# Altium schematic sheet Reference_voltage.SchDoc: Reference voltage
size A4; Date: 6.4.2015; Engineer: Matjaž Tome; Revision: B; SheetNumber: 9; SheetTotal: 10; Project: USB DAQ
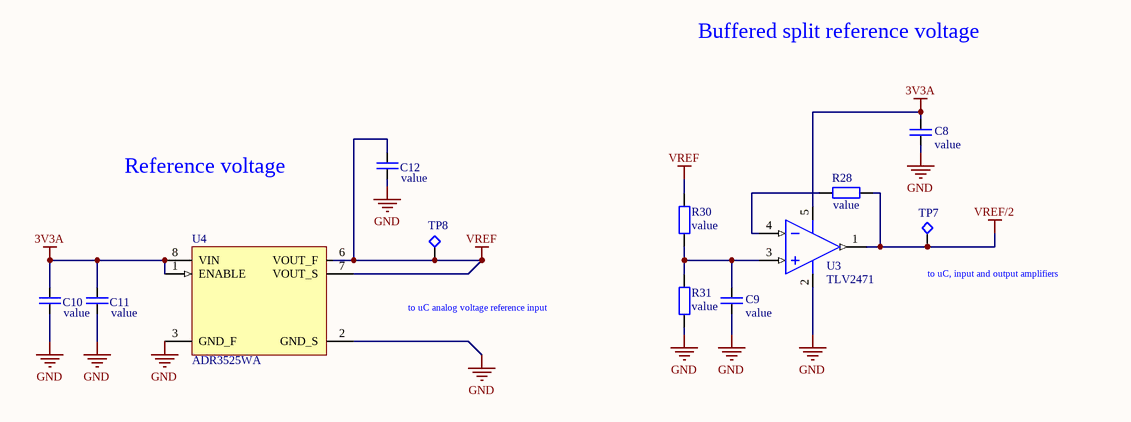
[diagram p0: Reference_voltage.SchDoc]

## Parts
C8  comment  [C_0603]  (value not drawn)
C9  comment  [C_0603]  (value not drawn)
C10  comment  [C_0603]  (value not drawn)
C11  comment  [C_0603]  (value not drawn)
C12  comment  [C_0603]  (value not drawn)
R28  comment  [R_0603]  (value not drawn)
R30  comment  [R_0603]  (value not drawn)
R31  comment  [R_0603]  (value not drawn)
TP7  test point 1.5mm  [TP1_FULL]  (value not drawn)
TP8  test point 1.5mm  [TP1_FULL]  (value not drawn)
U3  TLV2471  [SOT23-5]
U4  ADR3525WA  [MSOP8]

## Nets
3V3A: C8.2 C10.1 C11.1 U3.5(V+) U4.1(ENABLE) U4.8(VIN)
GND: C8.1 C9.2 C10.2 C11.2 C12.2 R31.1 U3.2(V-) U4.2(GND_S) U4.3(GND_F)
VREF: C12.1 R30.2 TP8.1 U4.6(VOUT_F) U4.7(VOUT_S)
VREF/2: R28.2 TP7.1 U3.1(OUT_A)
NetC9_1: C9.1 R30.1 R31.2 U3.3(+IN_A)
NetR28_1: R28.1 U3.4(-IN_A)

## Notes on the sheet
- Buffered split reference voltage
- Reference voltage
- (near TP7) to uC, input and output amplifiers
- to uC analog voltage reference input
- Title
- Date
- Project
- Rev
- Engineer
- Sheet
- of

## Library data of the parts
C8-C12 = Capacitor: Generic capacitor; Value: value
R28 R30 R31 = Resistor: Generic resistor; Value: value
TP7 TP8 = Test Point: Test point ,1.5mm diameter, no hole; Category: testpoints
U3 = TLV2471: Single, 6-V, 2.8-MHz, RRIO operational amplifier 5-SOT-23 -40 to 125; Manufacturer: Texas Instruments; Manufacturer Number: TLV2471IDBVT; Dealer number: 595-TLV2471IDBVT; Dealer: Mouser; Supply voltage max: 6V; Supply voltage min: 2.7V; Devices: 1; GBP: 2.8MHz; Rail to Rail: IN/OUT; Category: Integrated circuits; Price: 1.43; Case: SOT23-5; Technology: SMT; HelpURL: http://www.ti.com/general/docs/suppproductinfo.tsp?distId=26&gotoUrl=http%3A%2F%2Fwww.ti.com%2Flit%2Fgpn%2Ftlv2471
U4 = ADR3525W: Precision Voltage References 2.5V CMOS 8ppm/C; Part Number: VRX0002; Manufacturer: Analog devices; Manufacturer Number: ADR3525WARMZ-R7; Dealer number: 584-ADR3525WARMZ-R7; Dealer: Mouser; Max input voltage: 5.5V; Output current: 10mA; Voltage tolerance: 0.1%; Category: Integrated circuits; Price: 1.66; Output Voltage: 2.5V; Case: MSOP8; Technology: SMT; HelpURL: https://www.farnell.com/datasheets/1511785.pdf